# Altium project innovation-board.PrjPcb
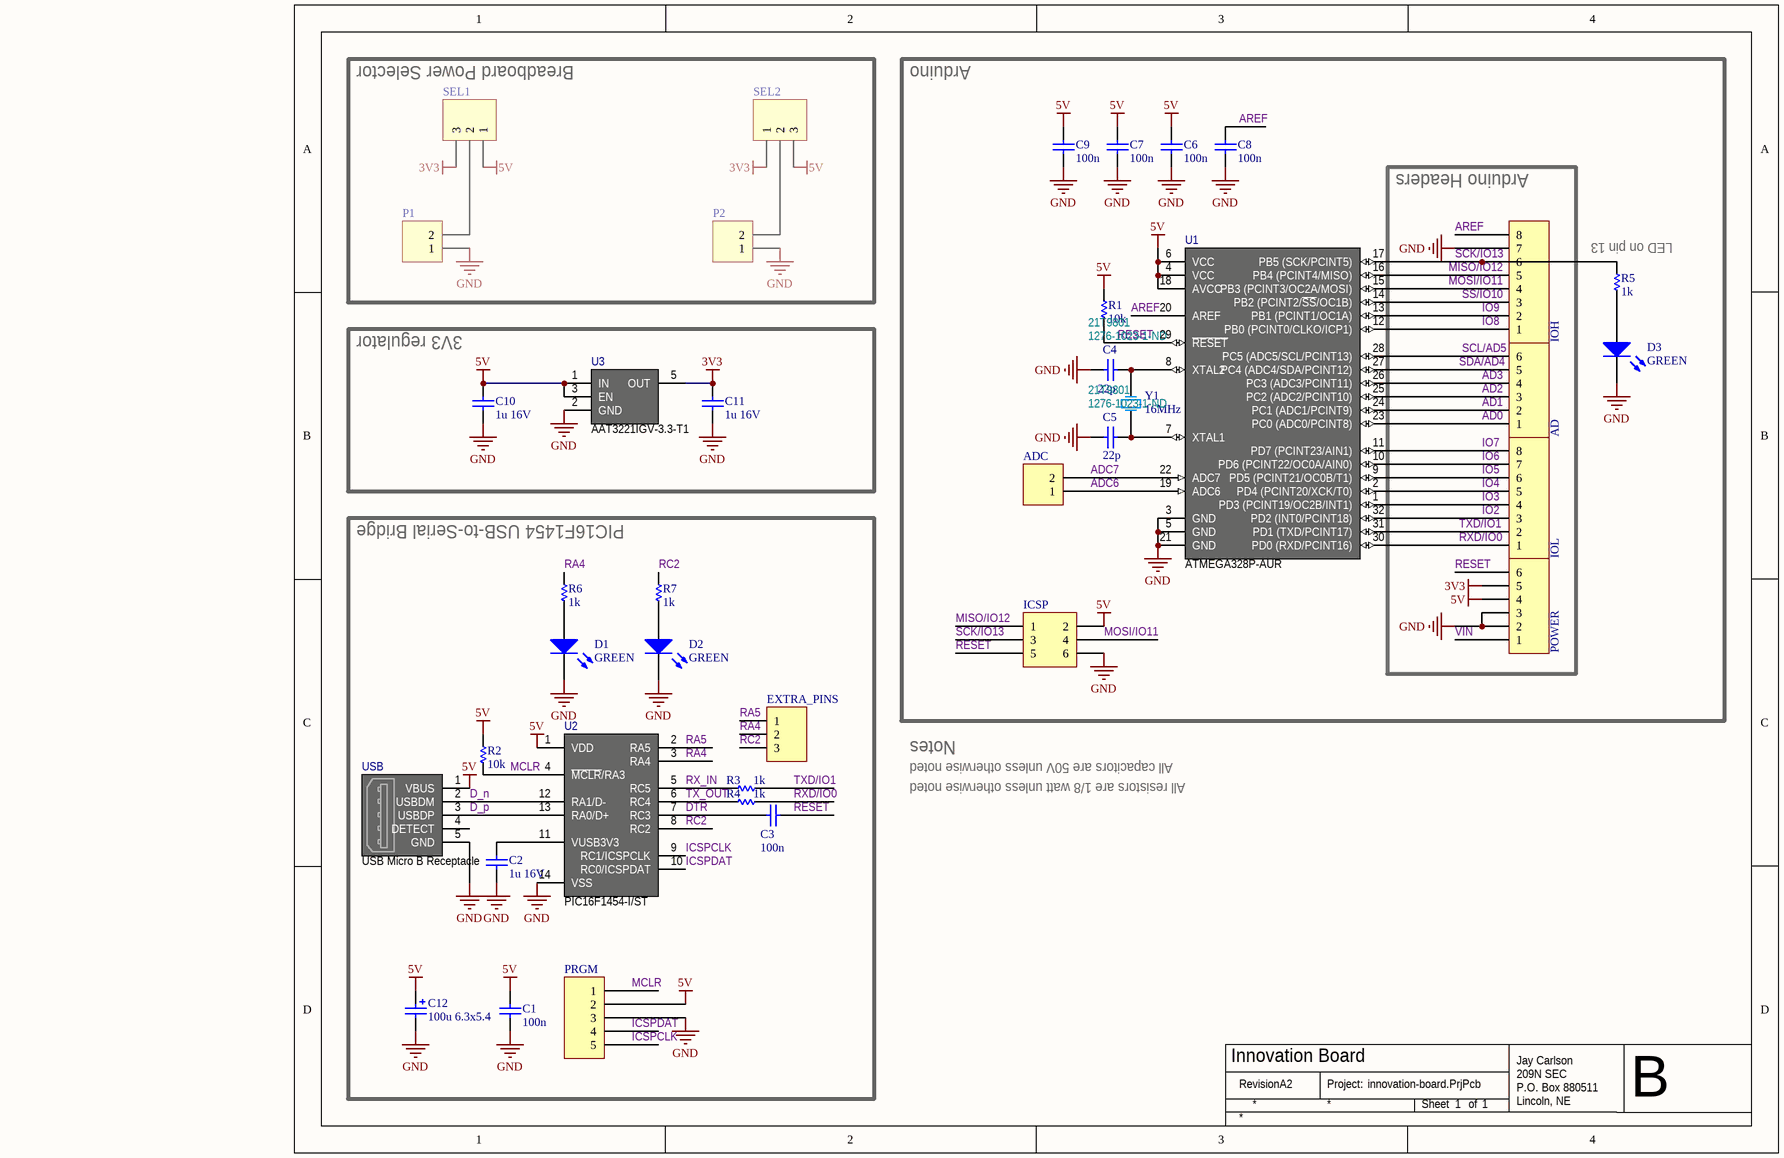
[diagram p0: innovation-board.SchDoc]
1 sheet, 39 parts. Net scope: global (net labels, ports and power ports of the same name join across sheets).
Board file: innovation-board.PcbDoc

## Sheet innovation-board.SchDoc: Innovation Board
size Letter; Revision: A2; SheetNumber: 1; SheetTotal: 1

### Parts
AD  Female Header 6  [HDR1X6]  (value not drawn)
ADC  DNI  [HDR1X2]  (value not drawn)  (no BOM)
C1  100n  [CAPC1608N]
C2  1u 16V  [CAPC1608N]
C3  100n  [CAPC1608N]
C4  22p  Supplier Part Number 1: 1276-1023-1-ND  Supplier Part Number 2: 21T9801  [CAPC1608N]
C5  22p  Supplier Part Number 1: 1276-1023-1-ND  Supplier Part Number 2: 21T9801  [CAPC1608N]
C6  100n  [CAPC1608N]
C7  100n  [CAPC1608N]
C8  100n  [CAPC1608N]
C9  100n  [CAPC1608N]
C10  1u 16V  [CAPC1608N]
C11  1u 16V  [CAPC1608N]
C12  100u 6.3x5.4  [CAP_63X54]
D1  GREEN  [LTST-C190GKT]
D2  GREEN  [LTST-C190GKT]
D3  GREEN  [LTST-C190GKT]
EXTRA_PINS  DNI  [HDR1X3]  (value not drawn)  (no BOM)
ICSP  DNI  [HDR2X3]  (value not drawn)  (no BOM)
IOH  Female Header 8  [HDR1X8]  (value not drawn)
IOL  Female Header 8  [HDR1X8]  (value not drawn)
P1  DNI  [HDR1X2]  (value not drawn)  (no BOM)
P2  DNI  [HDR1X2]  (value not drawn)  (no BOM)
POWER  Female Header 6  [HDR1X6]  (value not drawn)
PRGM  DNI  [HDR1X5]  (value not drawn)  (no BOM)
R1  10k  [RESC1608N]
R2  10k  [RESC1608N]
R3  1k  [RESC1608N]
R4  1k  [RESC1608N]
R5  1k  [RESC1608N]
R6  1k  [RESC1608N]
R7  1k  [RESC1608N]
SEL1  DNI  [HDR1X3]  (value not drawn)  (no BOM)
SEL2  DNI  [HDR1X3]  (value not drawn)  (no BOM)
U1  ATMEGA328P-AUR  [QFP80P900X900-32N]
U2  PIC16F1454-I/ST  [TSOP65P640-14AN]
U3  AAT3221IGV-3.3-T1  [SOT23-5AN]
USB  USB Micro B Receptacle  [10104110-0001LF]
Y1  16MHz  [HC49/4H_SMX]

### Blocks framed on the sheet
Breadboard Power Selector: P1 P2 SEL1 SEL2
Arduino: ADC C4-C9 D3 ICSP R1 R5 U1 Y1
Arduino Headers: AD IOH IOL POWER
3V3 regulator: C10 C11 U3
PIC16F1454 USB-to-Serial Bridge: C1-C3 C12 D1 D2 EXTRA_PINS PRGM R2-R4 R6 R7 U2 USB

### Nets
3V3: C11.1 POWER.5 SEL1.3 SEL2.1 U3.5(OUT)
5V: C1.2 C6.2 C7.2 C9.2 C10.1 C12.1 ICSP.2 POWER.4 PRGM.2 R1.1 R2.2 SEL1.1 SEL2.3 U1.4(VCC) U1.6(VCC) U1.18(AVCC) U2.1(VDD) U3.1(IN) U3.3(EN) USB.1(VBUS)
GND: C1.1 C2.1 C4.1 C5.1 C6.1 C7.1 C8.1 C9.1 C10.2 C11.2 C12.2 D1.2(K) D2.2(K) D3.2(K) ICSP.6 IOH.7 P1.1 P2.1 POWER.2 POWER.3 PRGM.3 U1.3(GND) U1.5(GND) U1.21(GND) U2.14(VSS) U3.2(GND) USB.5(GND)
AD0: AD.1 U1.23(PC0_(ADC0/PCINT8))
AD1: AD.2 U1.24(PC1_(ADC1/PCINT9))
AD2: AD.3 U1.25(PC2_(ADC2/PCINT10))
AD3: AD.4 U1.26(PC3_(ADC3/PCINT11))
ADC6: ADC.1 U1.19(ADC6)
ADC7: ADC.2 U1.22(ADC7)
AREF: C8.2 IOH.8 U1.20(AREF)
D_n: U2.12(RA1/D-) USB.2(USBDM)
D_p: U2.13(RA0/D+) USB.3(USBDP)
DTR: C3.1 U2.7(RC3)
ICSPCLK: PRGM.5 U2.9(RC1/ICSPCLK)
ICSPDAT: PRGM.4 U2.10(RC0/ICSPDAT)
IO2: IOL.3 U1.32(PD2_(INT0/PCINT18))
IO3: IOL.4 U1.1(PD3_(PCINT19/OC2B/INT1))
IO4: IOL.5 U1.2(PD4_(PCINT20/XCK/T0))
IO5: IOL.6 U1.9(PD5_(PCINT21/OC0B/T1))
IO6: IOL.7 U1.10(PD6_(PCINT22/OC0A/AIN0))
IO7: IOL.8 U1.11(PD7_(PCINT23/AIN1))
IO8: IOH.1 U1.12(PB0_(PCINT0/CLKO/ICP1))
IO9: IOH.2 U1.13(PB1_(PCINT1/OC1A))
MCLR: PRGM.1 R2.1 U2.4(~{MCLR}/RA3)
MISO/IO12: ICSP.1 IOH.5 U1.16(PB4_(PCINT4/MISO))
MOSI/IO11: ICSP.4 IOH.4 U1.15(PB3_(PCINT3/OC2A/MOSI))
RA4: EXTRA_PINS.2 R6.2 U2.3(RA4)
RA5: EXTRA_PINS.1 U2.2(RA5)
RC2: EXTRA_PINS.3 R7.2 U2.8(RC2)
RESET: C3.2 ICSP.5 POWER.6 R1.2 U1.29(~{RESET})
RX_IN: R3.1 U2.5(RC5)
RXD/IO0: IOL.1 R4.2 U1.30(PD0_(RXD/PCINT16))
SCK/IO13: ICSP.3 IOH.6 R5.2 U1.17(PB5_(SCK/PCINT5))
SCL/AD5: AD.6 U1.28(PC5_(ADC5/SCL/PCINT13))
SDA/AD4: AD.5 U1.27(PC4_(ADC4/SDA/PCINT12))
SS/IO10: IOH.3 U1.14(PB2_(PCINT2/~{SS}/OC1B))
TX_OUT: R4.1 U2.6(RC4)
TXD/IO1: IOL.2 R3.2 U1.31(PD1_(TXD/PCINT17))
VIN: POWER.1
NetC2_2: C2.2 U2.11(VUSB3V3)
NetC4_2: C4.2 U1.8(XTAL2) Y1.1(OSC1)
NetC5_2: C5.2 U1.7(XTAL1) Y1.2(OSC2)
NetD1_1: D1.1(A) R6.1
NetD2_1: D2.1(A) R7.1
NetD3_1: D3.1(A) R5.1
NetP1_2: P1.2 SEL1.2
NetP2_2: P2.2 SEL2.2

Not connected (* = marked no-connect by the designer): USB 4(DETECT)

### Notes on the sheet
- (near R5) LED on pin 13
- Notes
- All capacitors are 50V unless otherwise noted
- All resistors are 1/8 watt unless otherwise noted
- Revision
- Project:
- Sheet
- of
- Jay Carlson
  209N SEC
  P.O. Box 880511
  Lincoln, NE 68588-0511
- B

### Library data of the parts
AD POWER = Header 6: Female Header, 6-Pin; LatestRevisionDate: 17-Jul-2002; LatestRevisionNote: Re-released for DXP Platform.; Publisher: Altium Limited; Supplier 1: Digi-Key; Supplier Part Number 1: S7004-ND
ADC P1 P2 = Header 2: Header, 2-Pin; LatestRevisionDate: 17-Jul-2002; LatestRevisionNote: Re-released for DXP Platform.; Publisher: Altium Limited
C1 C6-C9 = Cap Semi: 100n 0603; Published: 8-Jun-2000; LatestRevisionDate: 29-May-2009; LatestRevisionNote: IPC-7351 Footprint Added.; PackageReference: C1206; Publisher: Altium Limited; PackageDescription: Chip Capacitor; Supplier 1: Digi-Key; Supplier Part Number 1: 1276-1012-1-ND
C2 = Cap Semi: 1u 16v 0603; Published: 8-Jun-2000; LatestRevisionDate: 29-May-2009; LatestRevisionNote: IPC-7351 Footprint Added.; PackageReference: C1206; Publisher: Altium Limited; PackageDescription: Chip Capacitor; Supplier 1: Digi-Key; Supplier Part Number 1: 1276-1243-1-ND
C3 = Cap Semi: Capacitor (Semiconductor SIM Model); Published: 8-Jun-2000; LatestRevisionDate: 29-May-2009; LatestRevisionNote: IPC-7351 Footprint Added.; PackageReference: C1206; Publisher: Altium Limited; PackageDescription: Chip Capacitor; Supplier 1: Digi-Key; Supplier Part Number 1: 1276-1012-1-ND
C4 = Cap Semi: 22pf 0603; Manufacturer: TDK; MC0603N220J201CT: Manufacturer Part Number; Published: 8-Jun-2000; LatestRevisionDate: 29-May-2009; LatestRevisionNote: IPC-7351 Footprint Added.; PackageReference: C1206; Publisher: Altium Limited; PackageDescription: Chip Capacitor; Supplier 1: Digi-Key; Supplier 2: Newark
C5 = Cap Semi: 22pf 0603; Manufacturer: TDK; Manufacturer Part Number: MC0603N220J201CT; Published: 8-Jun-2000; LatestRevisionDate: 29-May-2009; LatestRevisionNote: IPC-7351 Footprint Added.; PackageReference: C1206; Publisher: Altium Limited; PackageDescription: Chip Capacitor; Supplier 1: Digi-Key; Supplier 2: Newark
C10 C11 = Cap Semi: 1u 16v 0603; Value: 0603; Published: 8-Jun-2000; LatestRevisionDate: 29-May-2009; LatestRevisionNote: IPC-7351 Footprint Added.; PackageReference: C1206; Publisher: Altium Limited; PackageDescription: Chip Capacitor; Supplier 1: Digi-Key; Supplier Part Number 1: 1276-1041-1-ND; Supplier 2: Digi-Key; Supplier Part Number 2: 1276-1243-1-ND
C12 = Cap Pol1: Polarized Capacitor (Radial); Published: 8-Jun-2000; LatestRevisionDate: 17-Jul-2002; LatestRevisionNote: Re-released for DXP Platform.; PackageReference: RB7.6-15; Publisher: Altium Limited; PackageDescription: Polarized Capacitor (Radial); 2 Leads; Value: 100u; Supplier 1: Digi-Key; Supplier Part Number 1: 493-2105-1-ND
D1-D3 = LED_GREEN: Green LED 0603; Published: 8-Jun-2000; LatestRevisionDate: 17-Jul-2002; LatestRevisionNote: Re-released for DXP Platform.; PackageVersion: Feb-2002; PackageReference: 3.2X1.6X1.1; Publisher: Altium Limited; PackageDescription: SM LED; 2 Flat Leads; Supplier 1: Digi-Key; Supplier Part Number 1: 160-1183-1-ND
EXTRA_PINS SEL1 SEL2 = Header 3: Header, 3-Pin; LatestRevisionDate: 17-Jul-2002; LatestRevisionNote: Re-released for DXP Platform.; Publisher: Altium Limited
ICSP = Header 3X2: Header, 3-Pin, Dual row; LatestRevisionDate: 17-Jul-2002; LatestRevisionNote: Re-released for DXP Platform.; Publisher: Altium Limited
IOH IOL = Header 8: Female Header, 8-Pin; LatestRevisionDate: 17-Jul-2002; LatestRevisionNote: Re-released for DXP Platform.; Publisher: Altium Limited; Supplier 1: Digi-Key; Supplier Part Number 1: S7006-ND
PRGM = Header 5: Header, 5-Pin; LatestRevisionDate: 17-Jul-2002; LatestRevisionNote: Re-released for DXP Platform.; Publisher: Altium Limited
R1 R2 = Res Semi: 10k 0603; Published: 8-Jun-2000; LatestRevisionDate: 17-Jul-2002; LatestRevisionNote: Re-released for DXP Platform.; PackageReference: AXIAL-0.5; Publisher: Altium Limited; PackageDescription: Axial Device, Thru-Hole; 2 Leads; 0.5 in Pin Spacing; Supplier 1: Digi-Key; Supplier Part Number 1: RHM10KCGCT-ND
R3-R7 = Res Semi: 1k 0603; Published: 8-Jun-2000; LatestRevisionDate: 17-Jul-2002; LatestRevisionNote: Re-released for DXP Platform.; PackageReference: AXIAL-0.5; Publisher: Altium Limited; PackageDescription: Axial Device, Thru-Hole; 2 Leads; 0.5 in Pin Spacing; Supplier 1: Digi-Key; Supplier Part Number 1: RHM1.0KCGCT-ND
U1 = ATMEGA328P-AUR: ATMEL - ATMEGA328P-AUR - MCU, 8BIT, ATMEGA, 20MHZ, TQFP-32; Supplier 1: Newark; Manufacturer: ATMEL; Manufacturer Part Number: ATMEGA328P-AUR; RoHS: YES; Stock 1: 639; Pricing 1: 1=2.45, 10=2.1, 25=1.96, 100=1.87 (USD); ComponentLink1URL: http://www.farnell.com/datasheets/1693866.pdf; ComponentLink1Description: http://www.farnell.com/datasheets/1693866.pdf; Supplier 2: Digi-Key; Supplier 3: Mouser; Supplier Part Number 1: 87W8111; Supplier Part Number 2: ATMEGA328P-AURCT-ND; Supplier Part Number 3: 556-ATMEGA328P-AU
U2 = PIC16F1454-I/ST: 8-bit Microcontrollers - MCU 7 KB Flash 512 bytes RAM 48 MHz Int Osc; Manufacturer: Microchip Technology; Data RAM Size: 1024 B; Interface Type: USB; Number of I/Os: 11 I/O; Program Memory Size: 14 kB; Core: PIC; Data Bus Width: 8 bit; Maximum Clock Frequency: 48 MHz; Number of Timers: 3 Timer; On-Chip ADC: Yes; Operating Supply Voltage: 2.3 V to 5.5 V; Processor Series: PIC16; Product Status: New Product; Supplier 1: Mouser; Manufacturer Part Number: PIC16F1454-I/ST; RoHS: RoHS Compliant; Category: 8-bit Microcontrollers - MCU; Stock 1: 353; Pricing 1: 1=1.57, 10=1.31, 25=1.20, 100=1.09 (USD); Package / Case: TSSOP-14; Packaging: Tube; Program Memory Type: Flash; Brand: Microchip Technology; Data RAM Type: RAM; Mounting Style: SMD/SMT; Maximum Operating Temperature: + 85 C; Minimum Operating Temperature: - 40 C; Standard Pack Qty: 96; RoHS - Mouser: Y; Minimum Order Quantity: 1; Reeling: False; ComponentLink1URL: http://www.mouser.com/ds/2/268/41639A-218089.pdf; ComponentLink1Description: http://www.mouser.com/ds/2/268/41639A-218089.pdf; Supplier 2: Digi-Key; Supplier 3: Newark; Supplier Part Number 1: 579-PIC16F1454-I/ST; Supplier Part Number 2: PIC16F1454-I/ST-ND; Supplier Part Number 3: 53W9625
U3 = AAT3221IGV-3.3-T1: 3V3 Regulator; Supplier 1: Digi-Key; Supplier Part Number 1: 863-1491-1-ND
Y1 = XTAL: Crystal Oscillator (2 pin); Published: 8-Jun-2000; LatestRevisionDate: 17-Jul-2002; LatestRevisionNote: Re-released for DXP Platform.; PackageReference: R38; Publisher: Altium Limited; PackageDescription: Crystal, Thru-Hole; 2 Leads; Body 3.1 x 8.2 mm (Dia.xH); Supplier 1: Digi-Key; Supplier Part Number 1: 535-10226-1-ND
USB = USB Micro B Receptacle: Supplier 1: Newark; Supplier Part Number 1: 82R7424; Supplier 2: Digi-Key; Supplier Part Number 2: 609-4052-1-ND